# Altium project ST1-1.PrjPcb (part 1 of 5)
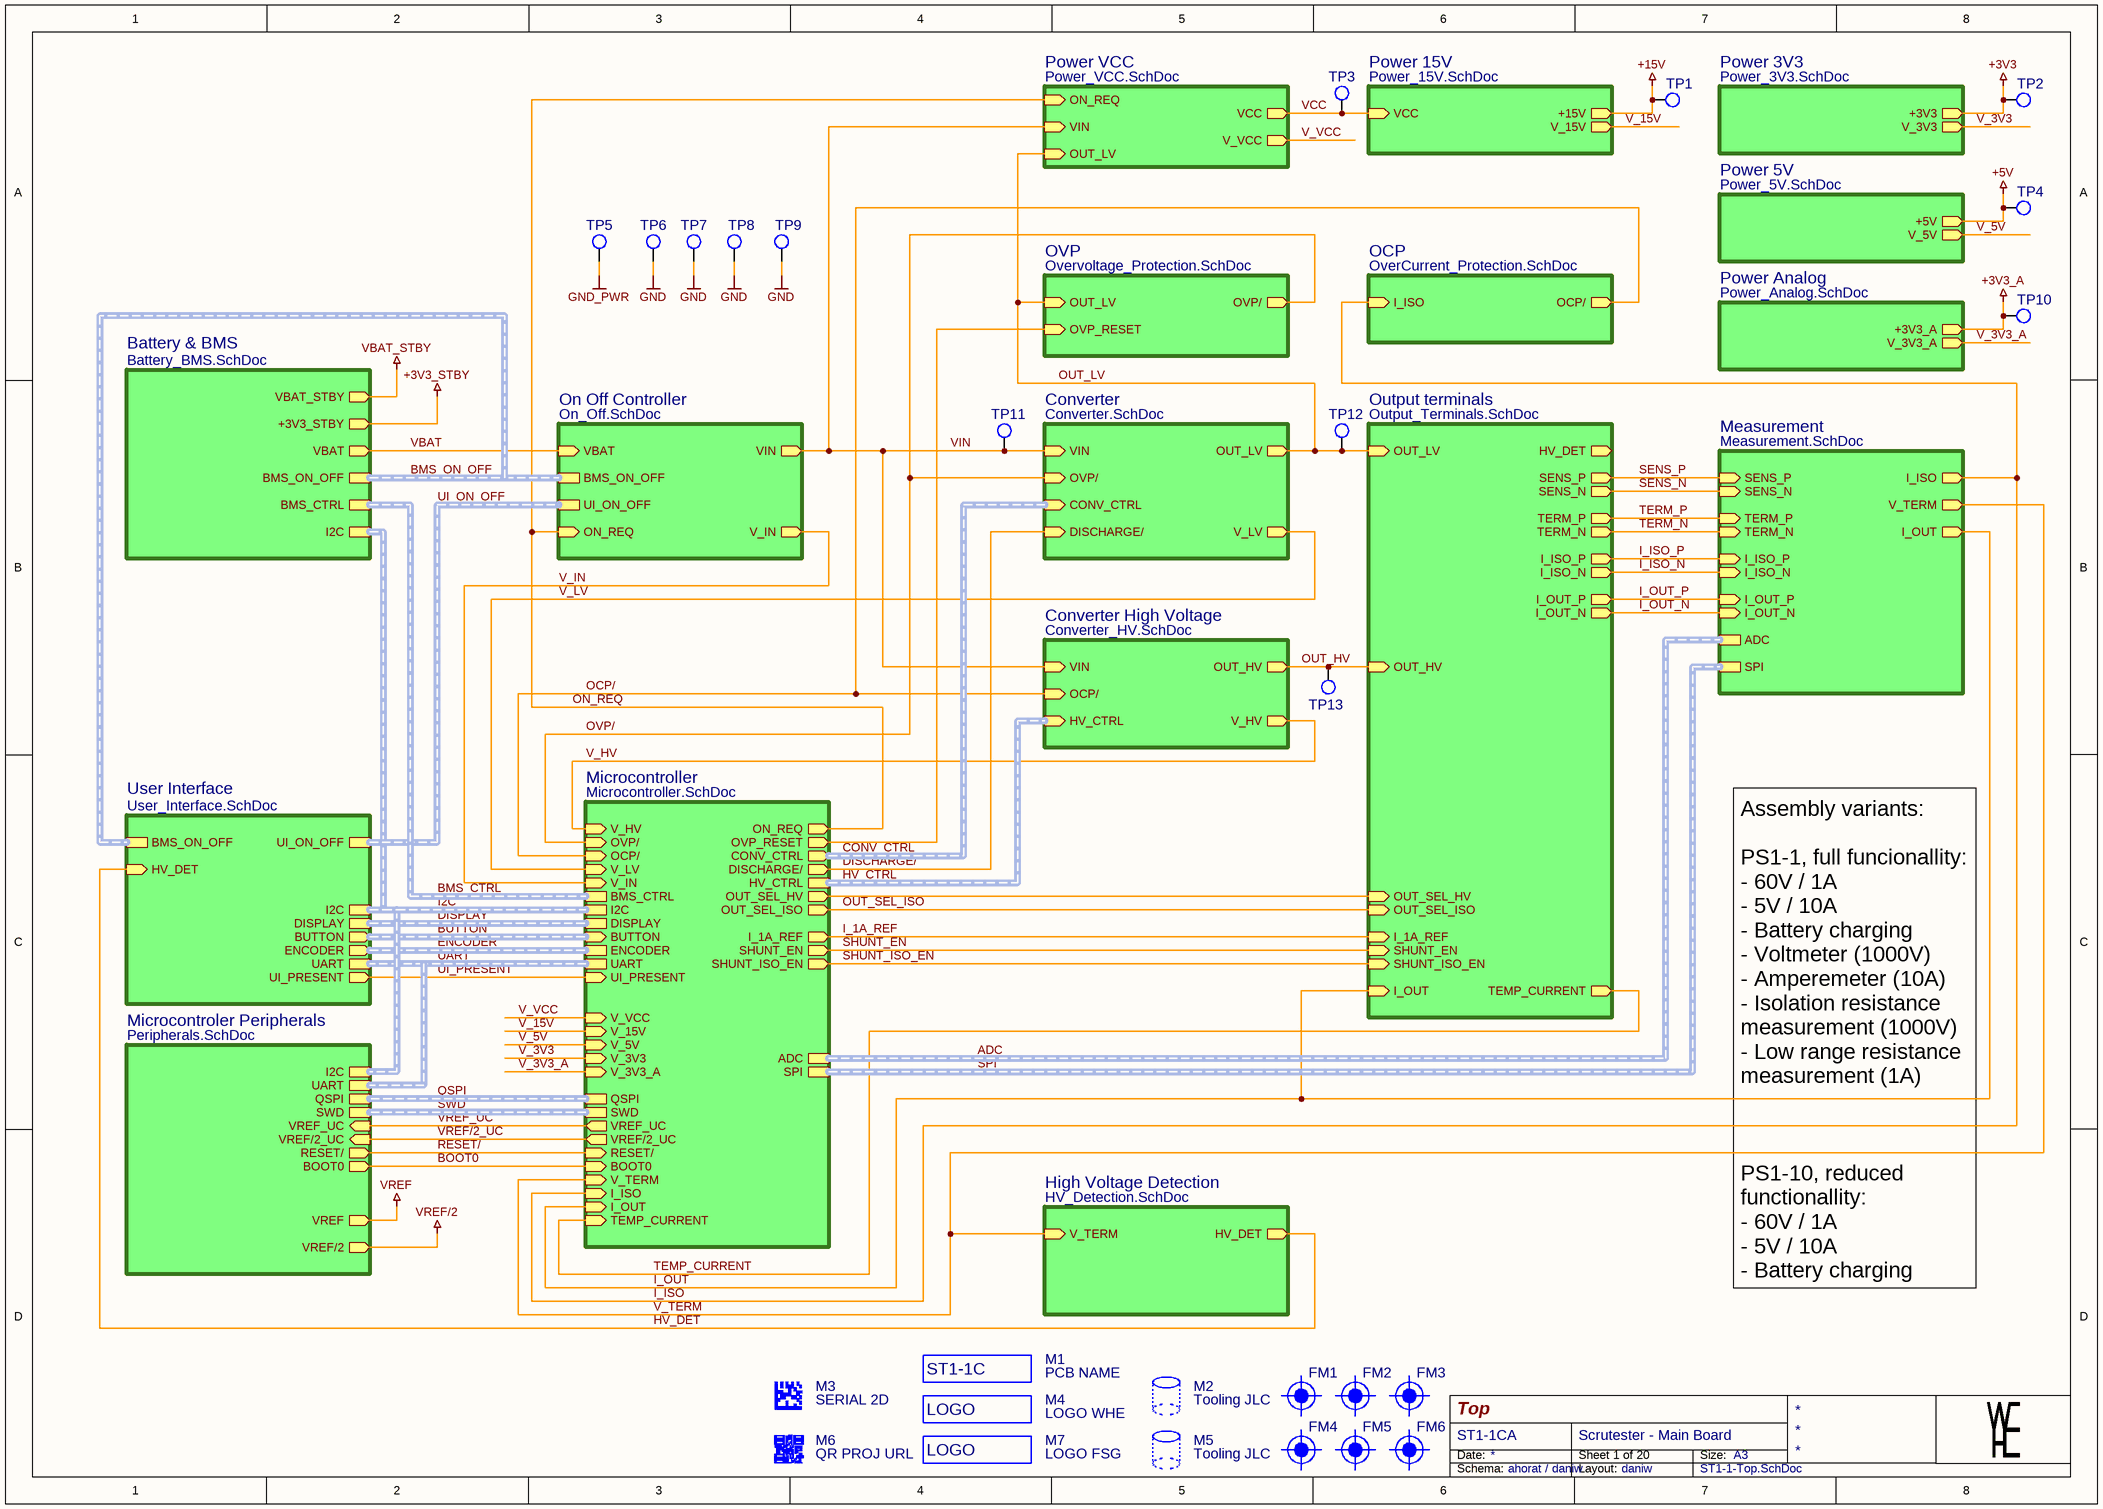
[diagram p0: ST1-1-Top.SchDoc]
Author: ahorat / daniw; Index_Main: C; Index_Sub: A; Layout_Designer: daniw; PCB_NAME: ST1-1; Project: Scrutester - Main Board; Project_URL: https://github.com/daniw/scrutester; Schema_Designer: ahorat / daniw
14 sheets, 534 parts. Net scope: hierarchical (ports join the sheet entries above them; power ports are global).
Board files: ST1-1-BASIS.PcbDoc, ST1-1-PANEL.PcbDoc
Sheets:
  ST1-1-Top.SchDoc
    Microcontroller = Microcontroller.SchDoc
    Battery & BMS = Battery_BMS.SchDoc
    User Interface = User_Interface.SchDoc
    Converter = Converter.SchDoc
    On Off Controller = On_Off.SchDoc
    Output terminals = Output_Terminals.SchDoc
      Precision Current Controller = Current_Controller.SchDoc
    Measurement = Measurement.SchDoc
    OVP = Overvoltage_Protection.SchDoc
    Microcontroler Peripherals = Peripherals.SchDoc
    OCP = Overcurrent_Protection.SchDoc
    High Voltage Detection = HV_Detection.SchDoc
  Iso_Current_Limit.SchDoc

## Sheet ST1-1-Top.SchDoc: Top
size A3; DocumentNumber: 1; SheetNumber: 1; SheetTotal: 20

### Parts
FM1  Fidu  [FIDU-1MM]  (value not drawn)  (no BOM)
FM2  Fidu  [FIDU-1MM]  (value not drawn)  (no BOM)
FM3  Fidu  [FIDU-1MM]  (value not drawn)  (no BOM)
FM4  Fidu  [FIDU-1MM]  (value not drawn)  (no BOM)
FM5  Fidu  [FIDU-1MM]  (value not drawn)  (no BOM)
FM6  Fidu  [FIDU-1MM]  (value not drawn)  (no BOM)
M1  PCB NAME  [PCB-NAME-5MM-LEFT]
M2  Tooling JLC  [TOOLING-JLC]
M3  SERIAL 2D  [SERIAL-2D-10MM-RESTRICT]
M4  LOGO WHE  [LOGO-WHE-10MM]
M5  Tooling JLC  [TOOLING-JLC]
M6  QR PROJ URL  [QR-PROJECT-URL-10MM]
M7  LOGO FSG  [LOGO-FSG-10MM]
TP1  TP_THD_1.5/0.8  [TP_THD_1.5/0.8]  (value not drawn)  (no BOM)
TP2  TP_THD_1.5/0.8  [TP_THD_1.5/0.8]  (value not drawn)  (no BOM)
TP3  TP_THD_1.5/0.8  [TP_THD_1.5/0.8]  (value not drawn)  (no BOM)
TP4  TP_THD_1.5/0.8  [TP_THD_1.5/0.8]  (value not drawn)  (no BOM)
TP5  TP_THD_1.5/0.8  [TP_THD_1.5/0.8]  (value not drawn)  (no BOM)
TP6  TP_THD_1.5/0.8  [TP_THD_1.5/0.8]  (value not drawn)  (no BOM)
TP7  TP_THD_1.5/0.8  [TP_THD_1.5/0.8]  (value not drawn)  (no BOM)
TP8  TP_THD_1.5/0.8  [TP_THD_1.5/0.8]  (value not drawn)  (no BOM)
TP9  TP_THD_1.5/0.8  [TP_THD_1.5/0.8]  (value not drawn)  (no BOM)
TP10  TP_THD_1.5/0.8  [TP_THD_1.5/0.8]  (value not drawn)  (no BOM)
TP11  TP_THD_1.5/0.8  [TP_THD_1.5/0.8]  (value not drawn)  (no BOM)
TP12  TP_THD_1.5/0.8  [TP_THD_1.5/0.8]  (value not drawn)  (no BOM)
TP13  TP_THD_1.5/0.8  [TP_THD_1.5/0.8]  (value not drawn)  (no BOM)

### Sub-sheets
Battery & BMS = Battery_BMS.SchDoc: VBAT (out), I2C (harness I2C), BMS_ON_OFF (harness BMS_ON_OFF), VBAT_STBY (out), BMS_CTRL (harness BMS_CTRL), +3V3_STBY (out)
Converter = Converter.SchDoc: VIN (in), CONV_CTRL (in, harness CONV_CTRL), OUT_LV (out), OVP/ (in), DISCHARGE/ (in), V_LV (out)
Converter High Voltage = Converter_HV.SchDoc (file not in this document): VIN (in), OUT_HV (out), OCP/ (in), HV_CTRL (in, harness HV_CTRL), V_HV (out)
High Voltage Detection = HV_Detection.SchDoc: V_TERM (in), HV_DET (out)
Measurement = Measurement.SchDoc: SENS_N (in), SENS_P (in), ADC (harness ADC), SPI (harness SPI), TERM_P (in), TERM_N (in), V_TERM (out), I_OUT (out), I_OUT_P (in), I_OUT_N (in), I_ISO_P (in), I_ISO_N (in), I_ISO (out)
Microcontroler Peripherals = Peripherals.SchDoc: I2C (harness I2C), UART (harness UART), QSPI (harness QSPI), VREF (out), SWD (harness SWD), VREF_UC (in), RESET/ (out), BOOT0 (out), VREF/2 (out), VREF/2_UC (in)
Microcontroller = Microcontroller.SchDoc: CONV_CTRL (out, harness CONV_CTRL), ON_REQ (out), I_1A_REF (out), SHUNT_EN (out), SPI (harness SPI), OUT_SEL_ISO (out), SHUNT_ISO_EN (out), V_HV (in), DISCHARGE/ (out), OVP/ (in), OUT_SEL_HV (out), HV_CTRL (harness HV_CTRL), OVP_RESET (out), OCP/ (in), BOOT0 (in), RESET/ (in), VREF/2_UC (out), VREF_UC (out), SWD (harness SWD), QSPI (harness QSPI), V_3V3_A (in), V_3V3 (in), V_5V (in), V_15V (in), V_VCC (in), UI_PRESENT (in), BMS_CTRL (harness BMS_CTRL), V_IN (in), V_LV (in), UART (harness UART), ENCODER (harness Encoder), BUTTON (in, harness BUTTON), DISPLAY (harness DISPLAY), I2C (harness I2C), ADC (harness ADC), TEMP_CURRENT (in), I_OUT (in), V_TERM (in), I_ISO (in)
OCP = OverCurrent_Protection.SchDoc: I_ISO (in), OCP/ (out)
On Off Controller = On_Off.SchDoc: VIN (out), VBAT (in), ON_REQ (in), V_IN (out), UI_ON_OFF (harness ON_OFF), BMS_ON_OFF (harness BMS_ON_OFF)
Output terminals = Output_Terminals.SchDoc: SENS_P (out), SENS_N (out), TERM_P (out), TERM_N (out), I_OUT_P (out), I_OUT_N (out), I_ISO_P (out), I_ISO_N (out), HV_DET (out), OUT_LV (in), OUT_SEL_HV (in), OUT_SEL_ISO (in), TEMP_CURRENT (out), I_OUT (in), I_1A_REF (in), SHUNT_EN (in), SHUNT_ISO_EN (in), OUT_HV (in)
OVP = Overvoltage_Protection.SchDoc: OUT_LV (in), OVP/ (out), OVP_RESET (in)
Power 3V3 = Power_3V3.SchDoc (file not in this document): +3V3 (out), V_3V3 (out)
Power 5V = Power_5V.SchDoc (file not in this document): +5V (out), V_5V (out)
Power 15V = Power_15V.SchDoc (file not in this document): +15V (out), VCC (in), V_15V (out)
Power Analog = Power_Analog.SchDoc (file not in this document): +3V3_A (out), V_3V3_A (out)
Power VCC = Power_VCC.SchDoc (file not in this document): VIN (in), OUT_LV (in), VCC (out), ON_REQ (in), V_VCC (out)
User Interface = User_Interface.SchDoc: ENCODER (out, harness Encoder), BUTTON (out, harness BUTTON), UI_ON_OFF (harness ON_OFF), I2C (harness I2C), HV_DET (in), UART (harness UART), UI_PRESENT (out), DISPLAY (harness DISPLAY), BMS_ON_OFF (harness BMS_ON_OFF)

### Nets
+3V3: TP2.1 ; sheet Power 3V3/+3V3
+3V3_A: TP10.1 ; sheet Power Analog/+3V3_A
+5V: TP4.1 ; sheet Power 5V/+5V
+15V: TP1.1 ; sheet Power 15V/+15V
GND: TP6.1 TP7.1 TP8.1 TP9.1
GND_PWR: TP5.1
BOOT0: sheet Microcontroller/BOOT0, sheet Microcontroler Peripherals/BOOT0
DISCHARGE/: sheet Microcontroller/DISCHARGE/, sheet Converter/DISCHARGE/
HV_DET: sheet User Interface/HV_DET, sheet High Voltage Detection/HV_DET
I_1A_REF: sheet Microcontroller/I_1A_REF, sheet Output terminals/I_1A_REF
I_ISO: sheet Microcontroller/I_ISO, sheet Measurement/I_ISO, sheet OCP/I_ISO
I_ISO_N: sheet Output terminals/I_ISO_N, sheet Measurement/I_ISO_N
I_ISO_P: sheet Output terminals/I_ISO_P, sheet Measurement/I_ISO_P
I_OUT: sheet Microcontroller/I_OUT, sheet Output terminals/I_OUT, sheet Measurement/I_OUT
I_OUT_N: sheet Output terminals/I_OUT_N, sheet Measurement/I_OUT_N
I_OUT_P: sheet Output terminals/I_OUT_P, sheet Measurement/I_OUT_P
OCP/: sheet Microcontroller/OCP/, sheet Converter High Voltage/OCP/, sheet OCP/OCP/
ON_REQ: sheet Microcontroller/ON_REQ, sheet On Off Controller/ON_REQ, sheet Power VCC/ON_REQ
OUT_HV: TP13.1 ; sheet Output terminals/OUT_HV, sheet Converter High Voltage/OUT_HV
OUT_LV: TP12.1 ; sheet Converter/OUT_LV, sheet Output terminals/OUT_LV, sheet Power VCC/OUT_LV, sheet OVP/OUT_LV
OUT_SEL_HV: sheet Microcontroller/OUT_SEL_HV, sheet Output terminals/OUT_SEL_HV
OUT_SEL_ISO: sheet Microcontroller/OUT_SEL_ISO, sheet Output terminals/OUT_SEL_ISO
OVP/: sheet Microcontroller/OVP/, sheet Converter/OVP/, sheet OVP/OVP/
OVP_RESET: sheet Microcontroller/OVP_RESET, sheet OVP/OVP_RESET
RESET/: sheet Microcontroller/RESET/, sheet Microcontroler Peripherals/RESET/
SENS_N: sheet Output terminals/SENS_N, sheet Measurement/SENS_N
SENS_P: sheet Output terminals/SENS_P, sheet Measurement/SENS_P
SHUNT_EN: sheet Microcontroller/SHUNT_EN, sheet Output terminals/SHUNT_EN
SHUNT_ISO_EN: sheet Microcontroller/SHUNT_ISO_EN, sheet Output terminals/SHUNT_ISO_EN
TEMP_CURRENT: sheet Microcontroller/TEMP_CURRENT, sheet Output terminals/TEMP_CURRENT
TERM_N: sheet Output terminals/TERM_N, sheet Measurement/TERM_N
TERM_P: sheet Output terminals/TERM_P, sheet Measurement/TERM_P
UI_PRESENT: sheet Microcontroller/UI_PRESENT, sheet User Interface/UI_PRESENT
V_3V3: sheet Microcontroller/V_3V3, sheet Power 3V3/V_3V3
V_3V3_A: sheet Microcontroller/V_3V3_A, sheet Power Analog/V_3V3_A
V_5V: sheet Microcontroller/V_5V, sheet Power 5V/V_5V
V_15V: sheet Microcontroller/V_15V, sheet Power 15V/V_15V
V_HV: sheet Microcontroller/V_HV, sheet Converter High Voltage/V_HV
V_IN: sheet Microcontroller/V_IN, sheet On Off Controller/V_IN
V_LV: sheet Microcontroller/V_LV, sheet Converter/V_LV
V_TERM: sheet Microcontroller/V_TERM, sheet Measurement/V_TERM, sheet High Voltage Detection/V_TERM
V_VCC: sheet Microcontroller/V_VCC, sheet Power VCC/V_VCC
VBAT: sheet Battery & BMS/VBAT, sheet On Off Controller/VBAT
VCC: TP3.1 ; sheet Power VCC/VCC, sheet Power 15V/VCC
VIN: TP11.1 ; sheet Converter/VIN, sheet On Off Controller/VIN, sheet Power VCC/VIN, sheet Converter High Voltage/VIN
VREF/2_UC: sheet Microcontroller/VREF/2_UC, sheet Microcontroler Peripherals/VREF/2_UC
VREF_UC: sheet Microcontroller/VREF_UC, sheet Microcontroler Peripherals/VREF_UC

### Buses and harness runs
harness ADC = sheet Measurement/ADC = sheet Microcontroller/ADC
harness BMS_CTRL = sheet Battery & BMS/BMS_CTRL = sheet Microcontroller/BMS_CTRL
harness BMS_ON_OFF = sheet Battery & BMS/BMS_ON_OFF = sheet On Off Controller/BMS_ON_OFF = sheet User Interface/BMS_ON_OFF
harness BUTTON = sheet Microcontroller/BUTTON = sheet User Interface/BUTTON
harness CONV_CTRL = sheet Converter/CONV_CTRL = sheet Microcontroller/CONV_CTRL
harness DISPLAY = sheet Microcontroller/DISPLAY = sheet User Interface/DISPLAY
harness ENCODER = sheet Microcontroller/ENCODER = sheet User Interface/ENCODER
harness HV_CTRL = sheet Converter High Voltage/HV_CTRL = sheet Microcontroller/HV_CTRL
harness I2C = sheet Battery & BMS/I2C = sheet Microcontroler Peripherals/I2C = sheet Microcontroller/I2C = sheet User Interface/I2C
harness QSPI = sheet Microcontroler Peripherals/QSPI = sheet Microcontroller/QSPI
harness SPI = sheet Measurement/SPI = sheet Microcontroller/SPI
harness SWD = sheet Microcontroler Peripherals/SWD = sheet Microcontroller/SWD
harness UART = sheet Microcontroler Peripherals/UART = sheet Microcontroller/UART = sheet User Interface/UART
harness UI_ON_OFF = sheet On Off Controller/UI_ON_OFF = sheet User Interface/UI_ON_OFF

### Notes on the sheet
- Assembly variants:
  PS1-1, full funcionallity:
  - 60V / 1A
  - 5V / 10A
  - Battery charging
  - Voltmeter (1000V)
  - Amperemeter (10A)
  - Isolation resistance measurement (1000V)
  - Low range resistance measurement (1A)
  PS1-10, reduced functionallity:
  - 60V / 1A
  - 5V / 10A
  - Battery charging
- Date:
- Size:
- A3
- Schema:
- Layout:

### Library data of the parts
FM1-FM6 = Fidu_1mm: Fiducial 1mm; Manufacturer: NONE; Part Number: Fidu_1mm
M1 = PCB NAME 5mm L: PCB name, 5mm text height, left-aligned; Manufacturer: NONE; Part Number: PCB NAME 5mm L
M2 M5 = Tooling JLC: Tooling hole for JLC (1.152mm); Manufacturer: NONE; Part Number: Tooling JLC
M3 = SERIAL 2D 10MM RESTRICT: 2D Serial number placeholder, Dotmatrix or QR, size: 10mm, restriction on top layer; Manufacturer: NONE; Part Number: SERIAL 2D 10MM RESTRICT
M4 = LOGO WHE 10MM: WHE logo, size 10mm; Manufacturer: NONE; Part Number: LOGO WHE 10MM
M6 = QR PROJ URL 10MM: QR Code, Project URL, 10mm; Manufacturer: NONE; Part Number: QR PROJ URL 10MM
M7 = LOGO FSG 10MM: FSG logo, size 10mm; Manufacturer: NONE; Part Number: LOGO FSG 10MM
TP1-TP13 = TP_THD_1.5/0.8: THT Test Point 1.5/0.8mm; Manufacturer: NONE; Part Number: TP_THD_1.5/0.8

## Sheet Microcontroller.SchDoc: Microcontroller
size A3; DocumentNumber: 13; SheetNumber: 13; SheetTotal: 19
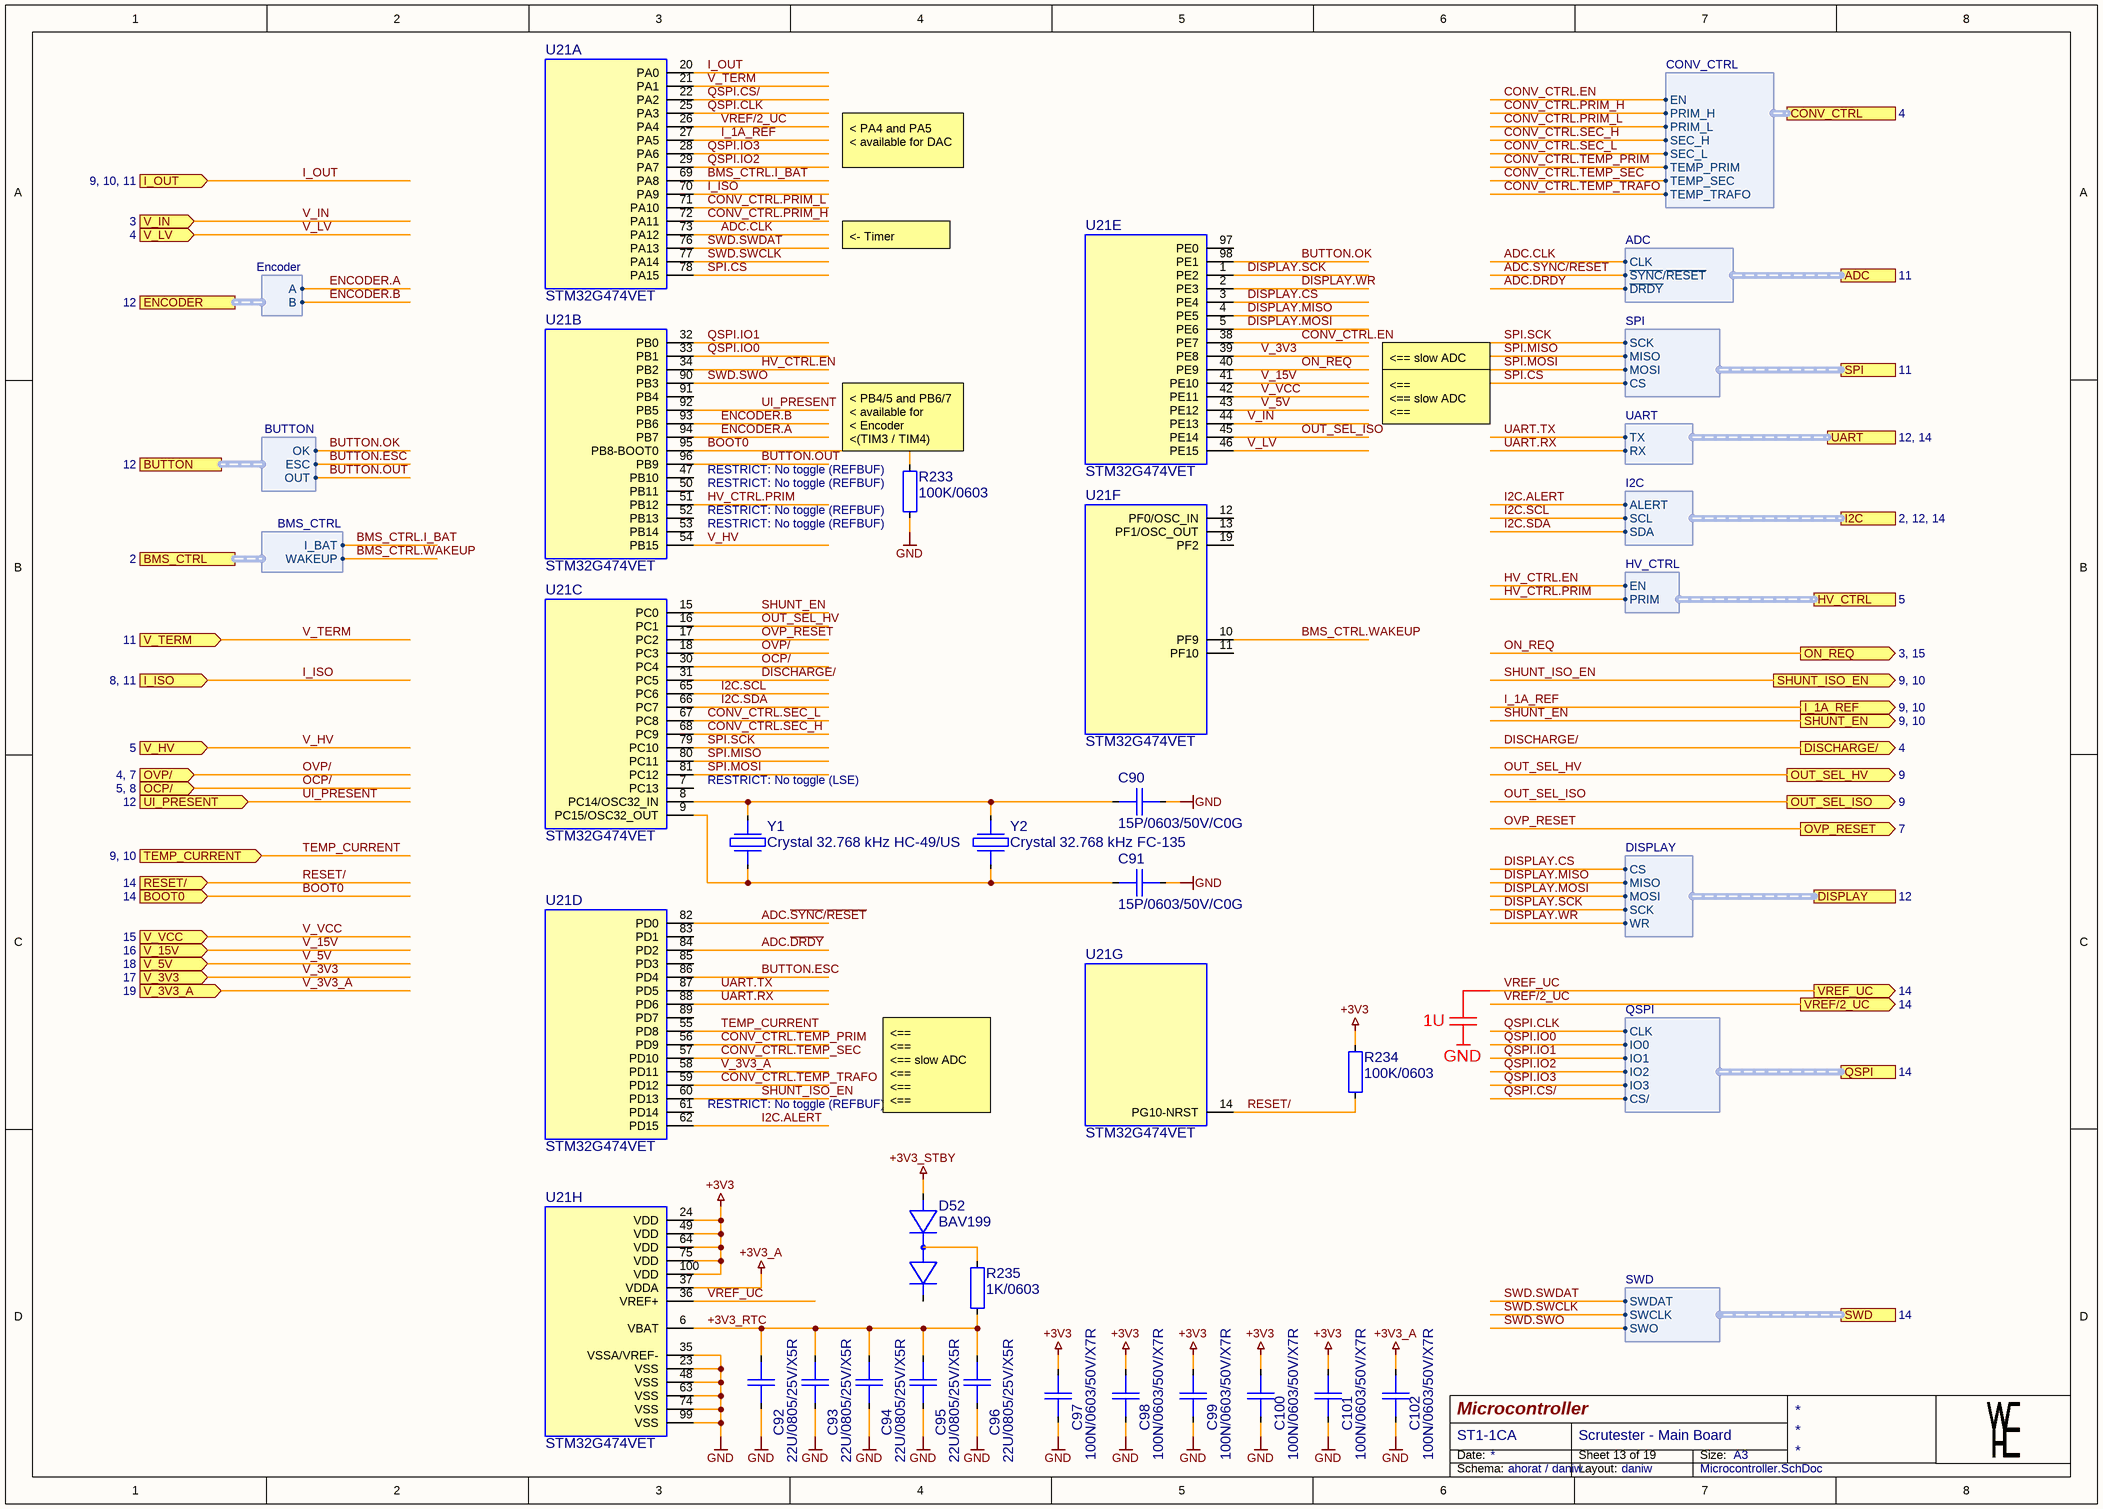
[diagram p1: Microcontroller.SchDoc]

### Parts
C90  15P/0603/50V/C0G  [CAP0603_C0G]
C91  15P/0603/50V/C0G  [CAP0603_C0G]
C92  22U/0805/25V/X5R  [CAP0805_X7R]
C93  22U/0805/25V/X5R  [CAP0805_X7R]
C94  22U/0805/25V/X5R  [CAP0805_X7R]
C95  22U/0805/25V/X5R  [CAP0805_X7R]
C96  22U/0805/25V/X5R  [CAP0805_X7R]
C97  100N/0603/50V/X7R  [CAP0603_X7R]
C98  100N/0603/50V/X7R  [CAP0603_X7R]
C99  100N/0603/50V/X7R  [CAP0603_X7R]
C100  100N/0603/50V/X7R  [CAP0603_X7R]
C101  100N/0603/50V/X7R  [CAP0603_X7R]
C102  100N/0603/50V/X7R  [CAP0603_X7R]
D52  BAV199  [SOT2395P280X125-3-SE]
R233  100K/0603  [R0603-0.40-WW]
R234  100K/0603  [R0603-0.40-WW]
R235  1K/0603  [R0603-0.40-WW]
U21  STM32G474VET  [QFP050P1600X1600X160-100]  (parts A,B,C,D,E,F,G,H of 8)
Y1  Crystal 32.768 kHz HC-49/US  [CYSMD275P760X320C230]
Y2  Crystal 32.768 kHz FC-135  [CYSMD250P320X150X090]

### Ports
ADC (harness ADC, see 11), BMS_CTRL (harness BMS_CTRL, see 2), BOOT0 (in, see 14), BUTTON (harness BUTTON, see 12), CONV_CTRL (harness CONV_CTRL, see 4), DISCHARGE/ (out, see 4), DISPLAY (harness DISPLAY, see 12), ENCODER (harness Encoder, see 12), HV_CTRL (harness HV_CTRL, see 5), I2C (harness I2C, see 2, 12, 14), I_1A_REF (out, see 9, 10), I_ISO (in, see 8, 11), I_OUT (in, see 9, 10, 11), OCP/ (in, see 5, 8), ON_REQ (out, see 3, 15), OUT_SEL_HV (out, see 9), OUT_SEL_ISO (out, see 9), OVP/ (in, see 4, 7), OVP_RESET (out, see 7), QSPI (harness QSPI, see 14), RESET/ (in, see 14), SHUNT_EN (out, see 9, 10), SHUNT_ISO_EN (out, see 9, 10), SPI (harness SPI, see 11), SWD (harness SWD, see 14), TEMP_CURRENT (in, see 9, 10), UART (harness UART, see 12, 14), UI_PRESENT (in, see 12), V_3V3 (in, see 17), V_3V3_A (in, see 19), V_5V (in, see 18), V_15V (in, see 16), V_HV (in, see 5), V_IN (in, see 3), V_LV (in, see 4), V_TERM (in, see 11), V_VCC (in, see 15), VREF/2_UC (out, see 14), VREF_UC (out, see 14)

### Harnesses
CONV_CTRL: EN, PRIM_H, SEC_H, TEMP_PRIM, TEMP_SEC, TEMP_TRAFO, PRIM_L, SEC_L
I2C: ALERT, SCL, SDA
BUTTON: ESC, OK, OUT
Encoder: A, B
ADC: CLK, ~{SYNC}/~{RESET}, ~{DRDY}
SPI: SCK, MISO, MOSI, CS
UART: TX, RX
BMS_CTRL: I_BAT, WAKEUP
HV_CTRL: EN, PRIM
DISPLAY: CS, MISO, MOSI, SCK, WR
QSPI: CLK, IO0, CS/, IO1, IO2, IO3
SWD: SWDAT, SWCLK, SWO

### Nets
+3V3: C97.1 C98.1 C99.1 C100.1 C101.1 R234.1 U21.24(VDD) U21.49(VDD) U21.64(VDD) U21.75(VDD) U21.100(VDD)
+3V3_A: C102.1 U21.37(VDDA)
+3V3_STBY: D52.1(A1)
GND: C90.2 C91.2 C92.2 C93.2 C94.2 C95.2 C96.2 C97.2 C98.2 C99.2 C100.2 C101.2 C102.2 R233.2 U21.23(VSS) U21.35(VSSA/VREF-) U21.48(VSS) U21.63(VSS) U21.74(VSS) U21.99(VSS)
+3V3_RTC: C92.1 C93.1 C94.1 C95.1 C96.1 R235.2 U21.6(VBAT)
ADC.CLK: U21.73(PA12) ; port ADC.CLK
ADC.~{DRDY}: U21.84(PD2) ; port ADC.~{DRDY}
ADC.~{SYNC}/~{RESET}: U21.82(PD0) ; port ADC.~{SYNC}/~{RESET}
BMS_CTRL.I_BAT: U21.69(PA8) ; port BMS_CTRL.I_BAT
BMS_CTRL.WAKEUP: U21.10(PF9) ; port BMS_CTRL.WAKEUP
BOOT0: R233.1 U21.95(PB8-BOOT0) ; port BOOT0
BUTTON.ESC: U21.86(PD4) ; port BUTTON.ESC
BUTTON.OK: U21.98(PE1) ; port BUTTON.OK
BUTTON.OUT: U21.96(PB9) ; port BUTTON.OUT
CONV_CTRL.EN: U21.38(PE7) ; port CONV_CTRL.EN
CONV_CTRL.PRIM_H: U21.72(PA11) ; port CONV_CTRL.PRIM_H
CONV_CTRL.PRIM_L: U21.71(PA10) ; port CONV_CTRL.PRIM_L
CONV_CTRL.SEC_H: U21.68(PC9) ; port CONV_CTRL.SEC_H
CONV_CTRL.SEC_L: U21.67(PC8) ; port CONV_CTRL.SEC_L
CONV_CTRL.TEMP_PRIM: U21.56(PD9) ; port CONV_CTRL.TEMP_PRIM
CONV_CTRL.TEMP_SEC: U21.57(PD10) ; port CONV_CTRL.TEMP_SEC
CONV_CTRL.TEMP_TRAFO: U21.59(PD12) ; port CONV_CTRL.TEMP_TRAFO
DISCHARGE/: U21.31(PC5) ; port DISCHARGE/
DISPLAY.CS: U21.3(PE4) ; port DISPLAY.CS
DISPLAY.MISO: U21.4(PE5) ; port DISPLAY.MISO
DISPLAY.MOSI: U21.5(PE6) ; port DISPLAY.MOSI
DISPLAY.SCK: U21.1(PE2) ; port DISPLAY.SCK
DISPLAY.WR: U21.2(PE3) ; port DISPLAY.WR
ENCODER.A: U21.94(PB7) ; port ENCODER.A
ENCODER.B: U21.93(PB6) ; port ENCODER.B
HV_CTRL.EN: U21.34(PB2) ; port HV_CTRL.EN
HV_CTRL.PRIM: U21.51(PB12) ; port HV_CTRL.PRIM
I2C.ALERT: U21.62(PD15) ; port I2C.ALERT
I2C.SCL: U21.65(PC6) ; port I2C.SCL
I2C.SDA: U21.66(PC7) ; port I2C.SDA
I_1A_REF: U21.27(PA5) ; port I_1A_REF
I_ISO: U21.70(PA9) ; port I_ISO
I_OUT: U21.20(PA0) ; port I_OUT
OCP/: U21.30(PC4) ; port OCP/
ON_REQ: U21.40(PE9) ; port ON_REQ
OUT_SEL_HV: U21.16(PC1) ; port OUT_SEL_HV
OUT_SEL_ISO: U21.45(PE14) ; port OUT_SEL_ISO
OVP/: U21.18(PC3) ; port OVP/
OVP_RESET: U21.17(PC2) ; port OVP_RESET
QSPI.CLK: U21.25(PA3) ; port QSPI.CLK
QSPI.CS/: U21.22(PA2) ; port QSPI.CS/
QSPI.IO0: U21.33(PB1) ; port QSPI.IO0
QSPI.IO1: U21.32(PB0) ; port QSPI.IO1
QSPI.IO2: U21.29(PA7) ; port QSPI.IO2
QSPI.IO3: U21.28(PA6) ; port QSPI.IO3
RESET/: R234.2 U21.14(PG10-NRST) ; port RESET/
SHUNT_EN: U21.15(PC0) ; port SHUNT_EN
SHUNT_ISO_EN: U21.60(PD13) ; port SHUNT_ISO_EN
SPI.CS: U21.78(PA15) ; port SPI.CS
SPI.MISO: U21.80(PC11) ; port SPI.MISO
SPI.MOSI: U21.81(PC12) ; port SPI.MOSI
SPI.SCK: U21.79(PC10) ; port SPI.SCK
SWD.SWCLK: U21.77(PA14) ; port SWD.SWCLK
SWD.SWDAT: U21.76(PA13) ; port SWD.SWDAT
SWD.SWO: U21.90(PB3) ; port SWD.SWO
TEMP_CURRENT: U21.55(PD8) ; port TEMP_CURRENT
UART.RX: U21.88(PD6) ; port UART.RX
UART.TX: U21.87(PD5) ; port UART.TX
UI_PRESENT: U21.92(PB5) ; port UI_PRESENT
V_3V3: U21.39(PE8) ; port V_3V3
V_3V3_A: U21.58(PD11) ; port V_3V3_A
V_5V: U21.43(PE12) ; port V_5V
V_15V: U21.41(PE10) ; port V_15V
V_HV: U21.54(PB15) ; port V_HV
V_IN: U21.44(PE13) ; port V_IN
V_LV: U21.46(PE15) ; port V_LV
V_TERM: U21.21(PA1) ; port V_TERM
V_VCC: U21.42(PE11) ; port V_VCC
VREF/2_UC: U21.26(PA4) ; port VREF/2_UC
VREF_UC: U21.36(VREF+) ; port VREF_UC
NetC90_1: C90.1 U21.8(PC14/OSC32_IN) Y1.1 Y2.1
NetC91_1: C91.1 U21.9(PC15/OSC32_OUT) Y1.2 Y2.2
NetD52_3: D52.3(K1/A2) R235.1

Not connected (* = marked no-connect by the designer): D52 2(K2); U21 7(PC13) 11(PF10) 12(PF0/OSC_IN) 13(PF1/OSC_OUT) 19(PF2) 47(PB10) 50(PB11) 52(PB13) 53(PB14) 61(PD14) 83(PD1) 85(PD3) 89(PD7) 91(PB4) 97(PE0)

### Notes on the sheet
- < PA4 and PA5
  < available for DAC
- <- Timer
- <== slow ADC
- (near R233) < PB4/5 and PB6/7
  < available for
  < Encoder
  <(TIM3 / TIM4)
- <==
  <== slow ADC
  <==
- RESTRICT: No toggle (REFBUF)
- RESTRICT: No toggle (LSE)
- Chose between crystals depending on available space on PCB
- 1U
- GND
- (near U21) RESTRICT: No toggle (REFBUF)
- <==
  <==
  <== slow ADC
  <==
  <==
  <==
- Date:
- Size:
- A3
- Schema:
- Layout:

### Library data of the parts
C90 C91 = 15P/0603/50V/C0G: CAP SM 0603 15pF 50V C0G; Manufacturer: GENERIC; Manufacturer 1: YAGEO; Manufacturer Part Number 1: CC0603JRNPO9BN150; Absolute Value: 1.5E-11; Eurocircuits GPN: GPC0603150-C0G; Part Number: 15P/0603/50V/C0G; Package: 0603; Value: 15pF; HelpURL: https://www.yageo.com/upload/media/product/productsearch/datasheet/mlcc/UPY-GP_NP0_16V-to-50V_18.pdf; Supplier 1: Digi-Key; Supplier Part Number 1: 311-1060-1-ND; Manufacturer 2: YAGEO; Manufacturer Part Number 2: CC0603KRNPO9BN150; Supplier 2: Digi-Key; Supplier Part Number 2: 311-4028-1-ND; JLC Type: Basic; Manufacturer Part Number 3: Samsung Electro-Mechanics; Supplier 3: LCSC; Supplier Part Number 3: C1644
C92-C96 = 22U/0805/25V/X5R: CAP SM 0805 22uF 25V X5R; Manufacturer: GENERIC; Manufacturer 1: Samsung Electro-Mechanics; Manufacturer Part Number 1: CL21A226MAYNNNE; Absolute Value: 2.2E-5; Eurocircuits GPN: GPN0805106-25; Part Number: 22U/0805/25V/X5R; Package: 0805; Value: 22uF; HelpURL: https://mm.digikey.com/Volume0/opasdata/d220001/medias/docus/339/CL21A226MAYNNNE_Spec.pdf; Supplier 1: Digi-Key; Supplier Part Number 1: 1276-CL21A226MAYNNNECT-ND; Manufacturer Part Number 3: CL21A226MAQNNNE; Supplier 3: LCSC; Supplier Part Number 3: C45783; JLC Type: Basic
C97-C102 = 100N/0603/50V/X7R: CAP SM 0603 100nF 50V X7R; Manufacturer: GENERIC; Manufacturer 1: YAGEO; Manufacturer Part Number 1: CC0603KPX7R9BB104; Absolute Value: 1E-7; Eurocircuits GPN: GPC0603104; Part Number: 100N/0603/50V/X7R; Package: 0603; Value: 100nF; HelpURL: https://www.yageo.com/upload/media/product/app/datasheet/mlcc/upy-gphc_x7r_6_3v-to-250v.pdf; Supplier 1: Digi-Key; Supplier Part Number 1: 311-3567-1-ND; Supplier 3: LCSC; Supplier Part Number 3: C14663; Manufacturer 2: YAGEO; Manufacturer Part Number 2: CC0603MRX7R9BB104; Supplier 2: Digi-Key; Supplier Part Number 2: 311-4110-1-ND; JLC Type: Basic; Manufacturer Part Number 3: CC0603KRX7R9BB104
D52 = BAV199: Silicon Low Leakage Diode 85V; Manufacturer: Infineon Technologies; Manufacturer Part Number 1: BAV199E6433HTMA1; Part Number: BAV199; Package: SOT23; Value: BAV199; Absolute Value: 85V; HelpURL: https://www.infineon.com/dgdl/bav199series.pdf?folderId=db3a30431400ef6801141c748874044e&fileId=db3a30431400ef6801141cba733104e5; Manufacturer 1: Infineon Technologies; Supplier 1: Digikey; Supplier Part Number 1: BAV199E6433HTMA1CT-ND; Manufacturer 3: LRC; Manufacturer Part Number 3: LBAV199LT1G; Supplier 3: LCSC; Supplier Part Number 3: C12740
R233 R234 = 100K/0603: RES SM 0603 100K; Manufacturer: GENERIC; Manufacturer 1: YAGEO; Manufacturer Part Number 1: RC0603FR-13100KL; Absolute Value: 100000; Eurocircuits GPN: GPR0603100K; Part Number: 100K/0603; Package: 0603; Value: 100K; HelpURL: https://www.yageogroup.com/content/datasheet/asset/file/PYU-RC_GROUP_51_ROHS_L; Supplier 1: Digi-Key; Supplier Part Number 1: 13-RC0603FR-13100KLCT-ND; Manufacturer 2: YAGEO; Manufacturer Part Number 2: RC0603FR-10100KL; Supplier 2: Digi-Key; Supplier Part Number 2: 13-RC0603FR-10100KLCT-ND; Manufacturer 3: UNI-ROYAL(Uniroyal Elec); Manufacturer Part Number 3: 0603WAF1003T5E; Supplier 3: LCSC; Supplier Part Number 3: C25803; JLC Type: Basic
R235 = 1K/0603: RES SM 0603 1K; Manufacturer: GENERIC; Manufacturer 1: YAGEO; Manufacturer Part Number 1: RC0603FR-131KL; Absolute Value: 1000; Eurocircuits GPN: GPR06031K; Part Number: 1K/0603; Package: 0603; Value: 1K; HelpURL: https://www.yageogroup.com/content/datasheet/asset/file/PYU-RC_GROUP_51_ROHS_L; Supplier 1: Digi-Key; Supplier Part Number 1: 13-RC0603FR-131KLCT-ND; Manufacturer 2: YAGEO; Manufacturer Part Number 2: RC0603FR-101KL; Supplier 2: Digi-Key; Supplier Part Number 2: 13-RC0603FR-101KLCT-ND; Manufacturer 3: UNI-ROYAL(Uniroyal Elec); Manufacturer Part Number 3: 0603WAF1001T5E; Supplier 3: LCSC; Supplier Part Number 3: C21190; JLC Type: Basic
U21 = STM32G474VET: STM32G474VET, Arm® Cortex®-M4 32-bit MCU+FPU, 170 MHz / 213 DMIPS, 512 kB flash, 128 KB SRAM, rich analog, math acc, 184 ps 12 chan Hi-res timer, QFP-100; Manufacturer: ST Microelectronics; Manufacturer 1: STMicroelectronics; Manufacturer Part Number 1: STM32G474VET6; Part Number: STM32G474VET; Package: QFP-100; HelpURL: https://www.st.com/resource/en/datasheet/stm32g474ve.pdf; Supplier 1: Digi-Key; Supplier Part Number 1: 497-19476-ND; Manufacturer 2: STMicroelectronics; Manufacturer Part Number 2: STM32G474VET3; Supplier 2: Digi-Key; Supplier Part Number 2: 497-STM32G474VET3-ND; Manufacturer 3: STMicroelectronics; Manufacturer Part Number 3: STM32G474VET6TR; Supplier 3: LCSC; Supplier Part Number 3: C1857438; JLC Type: Extended
Y1 = Crystal 32.768 kHz HC-49/US: 32.768 kHz ±20ppm Crystal 12,5pF HC-49/US; Manufacturer: CJKJ; Part Number: Crystal 32.768 kHz HC-49/US; Package: HC-49/US; HelpURL: https://www.lcsc.com/datasheet/C1122370.pdf; Manufacturer 3: CJKJ; Manufacturer Part Number 3: C30732.768N12.5M20; Supplier 3: LCSC; Supplier Part Number 3: C1122370; JLC Type: Extended
Y2 = Crystal 32.768 kHz FC-135: 32.768 kHz ±20ppm Crystal 12,5pF FC-135; Manufacturer: Epson; Manufacturer Part Number 1: FC-135 32.7680KA-A5; Part Number: Crystal 32.768 kHz FC-135; Package: FC-135; HelpURL: https://support.epson.biz/td/api/doc_check.php?dl=brief_FC-135; Manufacturer 1: EPSON; Supplier 1: Digi-Key; Supplier Part Number 1: SER4103CT-ND; Manufacturer 3: EPSON; Manufacturer Part Number 3: Q13FC13500004; Supplier 3: LCSC; Supplier Part Number 3: C32346; JLC Type: Basic

## Sheet Battery_BMS.SchDoc: Battery & BMS
size A3; DocumentNumber: 2; SheetNumber: 2; SheetTotal: 19
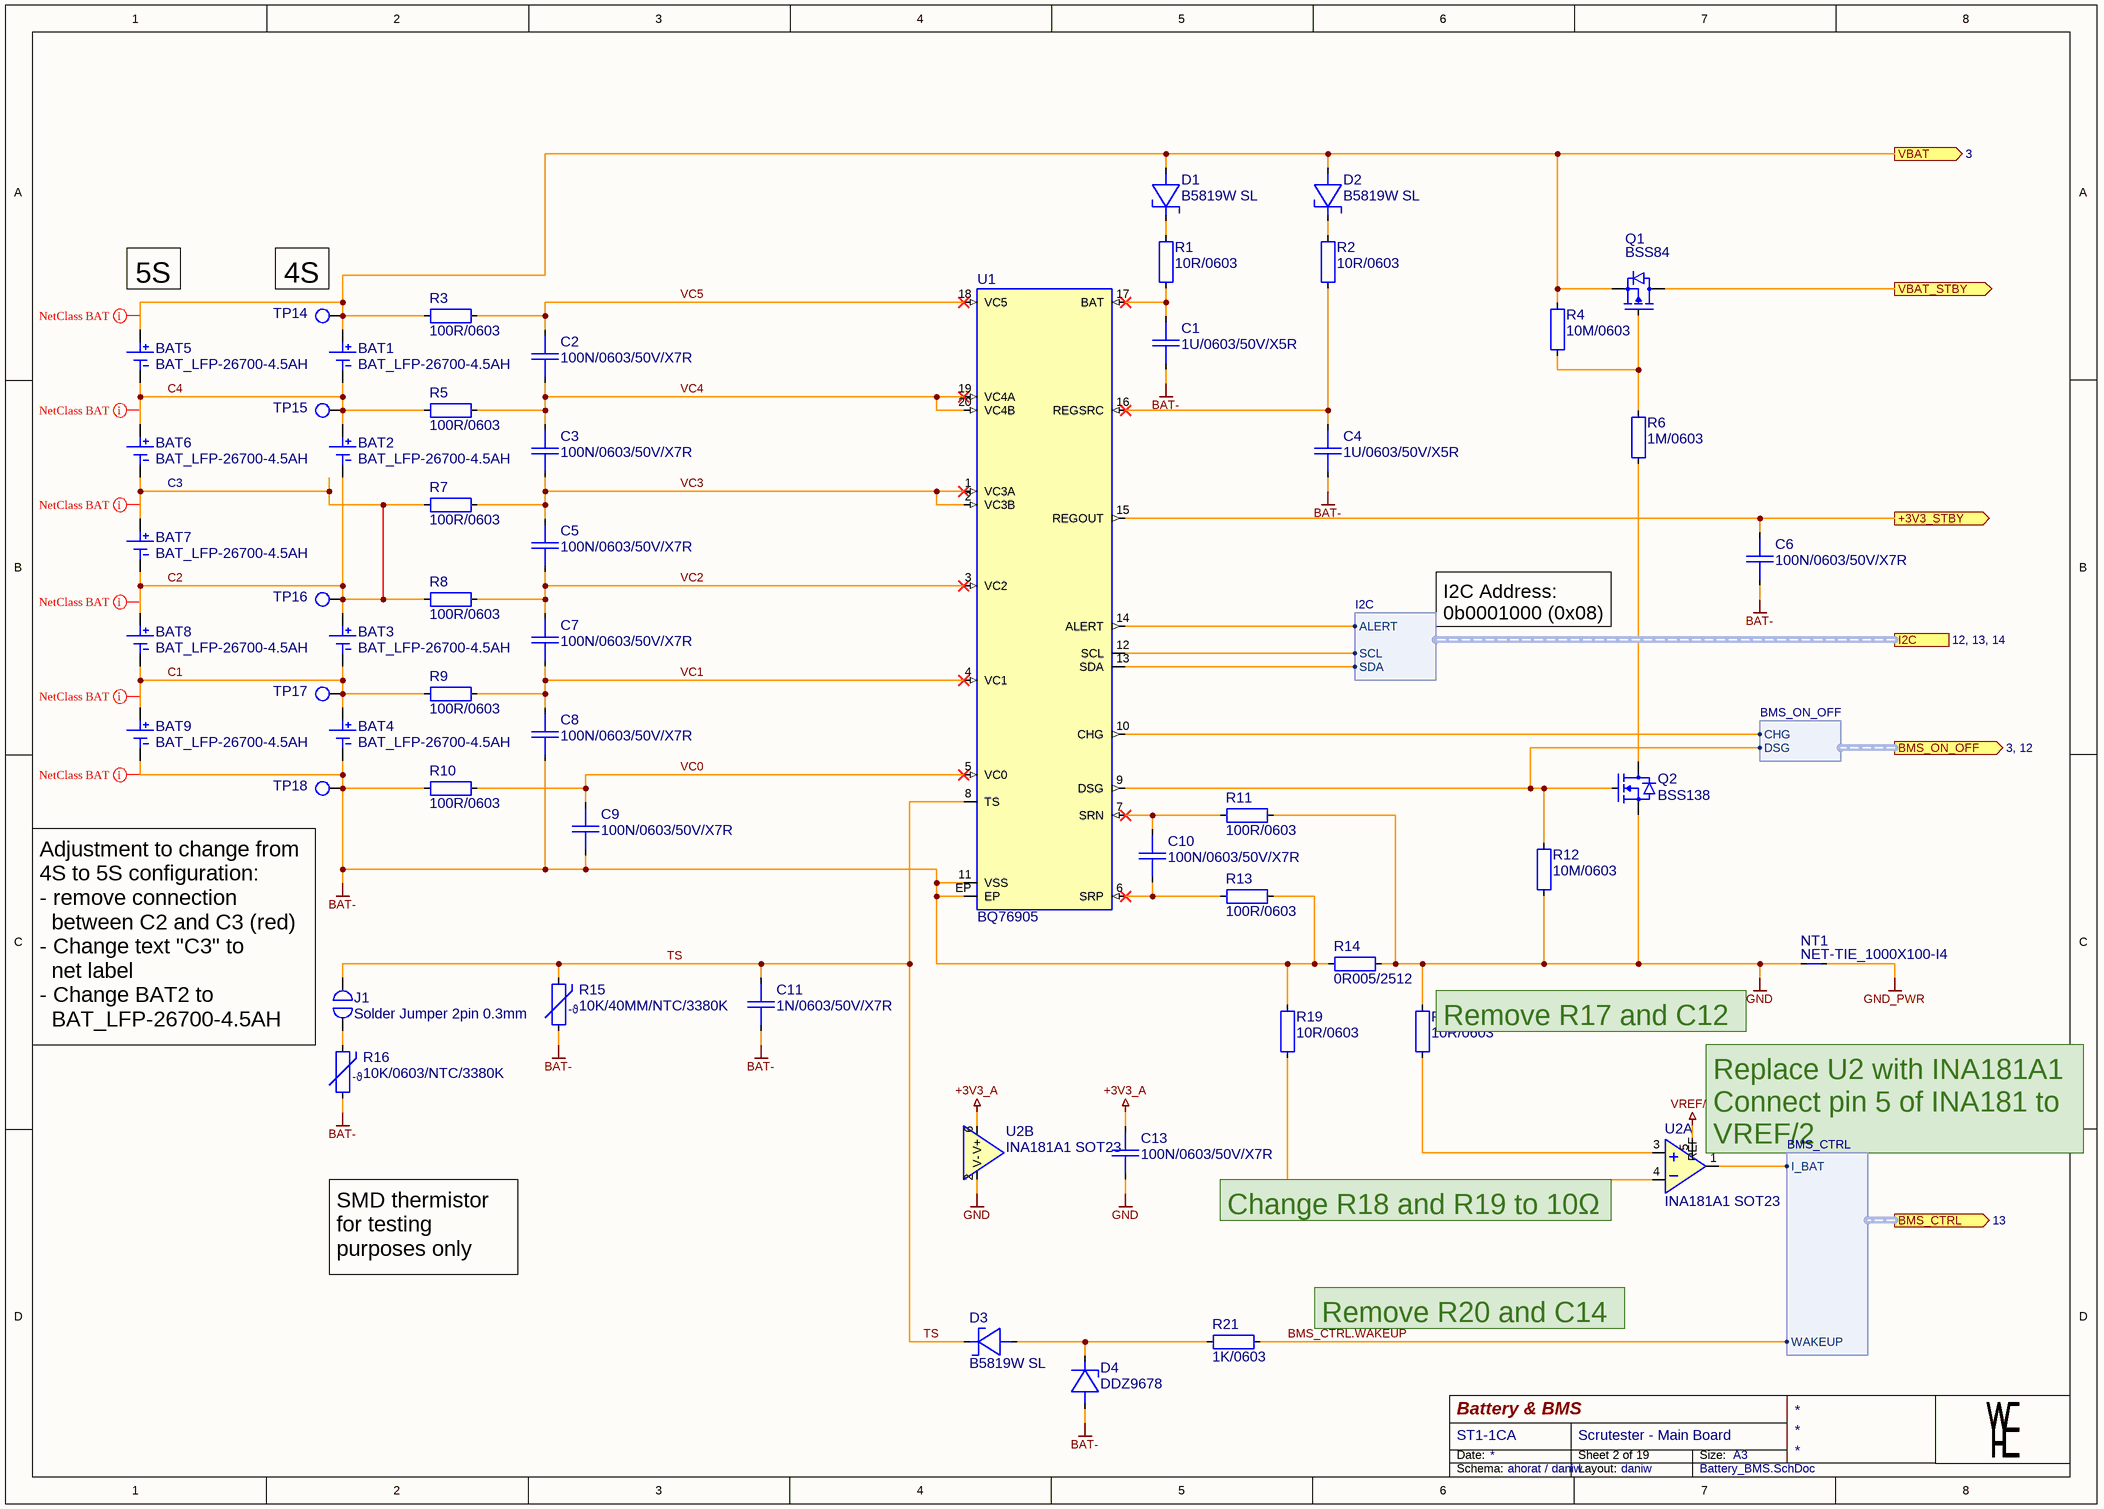
[diagram p2: Battery_BMS.SchDoc]

### Parts
BAT1  BAT_LFP-26700-4.5AH  [BAT-26700-PS]
BAT2  BAT_LFP-26700-4.5AH  [BAT-26700-PS]
BAT3  BAT_LFP-26700-4.5AH  [BAT-26700-PS]
BAT4  BAT_LFP-26700-4.5AH  [BAT-26700-PS]
BAT5  BAT_LFP-26700-4.5AH  [BAT-26700-PS]  (graphical)
BAT6  BAT_LFP-26700-4.5AH  [BAT-26700-PS]  (graphical)
BAT7  BAT_LFP-26700-4.5AH  [BAT-26700-PS]  (graphical)
BAT8  BAT_LFP-26700-4.5AH  [BAT-26700-PS]  (graphical)
BAT9  BAT_LFP-26700-4.5AH  [BAT-26700-PS]  (graphical)
C1  1U/0603/50V/X5R  [CAP0603_X7R]
C2  100N/0603/50V/X7R  [CAP0603_X7R]
C3  100N/0603/50V/X7R  [CAP0603_X7R]
C4  1U/0603/50V/X5R  [CAP0603_X7R]
C5  100N/0603/50V/X7R  [CAP0603_X7R]
C6  100N/0603/50V/X7R  [CAP0603_X7R]
C7  100N/0603/50V/X7R  [CAP0603_X7R]
C8  100N/0603/50V/X7R  [CAP0603_X7R]
C9  100N/0603/50V/X7R  [CAP0603_X7R]
C10  100N/0603/50V/X7R  [CAP0603_X7R]
C11  1N/0603/50V/X7R  [CAP0603_X7R]
C13  100N/0603/50V/X7R  [CAP0603_X7R]
D1  B5819W SL  [SOD3718X125]
D2  B5819W SL  [SOD3718X125]
D3  B5819W SL  [SOD3718X125]
D4  DDZ9678  [SOD3718X125]
J1  Solder Jumper 2pin 0.3mm  [Solder_Jumper_2pin_0.3mm]
NT1  NET-TIE_1000X100-I4  [NET-TIE_1000X100]  (net tie, no BOM)
Q1  BSS84  [SOT2395P280X125-3-SE]
Q2  BSS138  [SOT2395P280X125-3-SE]
R1  10R/0603  [R0603-0.40-WW]
R2  10R/0603  [R0603-0.40-WW]
R3  100R/0603  [R0603-0.40-WW]
R4  10M/0603  [R0603-0.40-WW]
R5  100R/0603  [R0603-0.40-WW]
R6  1M/0603  [R0603-0.40-WW]
R7  100R/0603  [R0603-0.40-WW]
R8  100R/0603  [R0603-0.40-WW]
R9  100R/0603  [R0603-0.40-WW]
R10  100R/0603  [R0603-0.40-WW]
R11  100R/0603  [R0603-0.40-WW]
R12  10M/0603  [R0603-0.40-WW]
R13  100R/0603  [R0603-0.40-WW]
R14  0R005/2512  [R2512-0.65-WW]
R15  10K/40MM/NTC/3380K  [RESD200W25D200H4000]
R16  10K/0603/NTC/3380K  [R0603-0.40-WW]
R18  10R/0603  [R0603-0.40-WW]
R19  10R/0603  [R0603-0.40-WW]
R21  1K/0603  [R0603-0.40-WW]
TP14  TP_THD_1.5/0.8  [TP_THD_1.5/0.8]  (value not drawn)  (no BOM)
TP15  TP_THD_1.5/0.8  [TP_THD_1.5/0.8]  (value not drawn)  (no BOM)
TP16  TP_THD_1.5/0.8  [TP_THD_1.5/0.8]  (value not drawn)  (no BOM)
TP17  TP_THD_1.5/0.8  [TP_THD_1.5/0.8]  (value not drawn)  (no BOM)
TP18  TP_THD_1.5/0.8  [TP_THD_1.5/0.8]  (value not drawn)  (no BOM)
U1  BQ76905  [QFN050P350X350X100-20-EP200X200]
U2  INA181A1 SOT23  [SOT2395P280X125-6-SE]  (parts A,B of 2)

### Ports
+3V3_STBY (out), BMS_CTRL (out, harness BMS_CTRL, see 13), BMS_ON_OFF (out, harness BMS_ON_OFF, see 3, 12), I2C (harness I2C, see 12, 13, 14), VBAT (out, see 3), VBAT_STBY (out)

### Harnesses
I2C: ALERT, SCL, SDA
BMS_ON_OFF: CHG, DSG
BMS_CTRL: I_BAT, WAKEUP

### Nets
+3V3_A: C13.1 U2.6(V+)
+3V3_STBY: C6.1 U1.15(REGOUT) ; port +3V3_STBY
BAT-: BAT4.2(-) BAT9.2(-) C1.2 C4.2 C6.2 C8.2 C9.2 C11.2 D4.2(A) R10.1 R13.2 R14.1 R15.2 R16.2 R19.1 TP18.1 U1.11(VSS) U1.EP
GND: C13.2 NT1.1 Q2.2(SOURCE) R11.2 R12.2 R14.2 R18.1 U2.2(V-)
GND_PWR: NT1.2
VBAT_STBY: Q1.3(DRAIN) ; port VBAT_STBY
VREF/2: U2.5(REF)
BMS_CTRL.I_BAT: U2.1(OUT) ; port BMS_CTRL.I_BAT
BMS_CTRL.WAKEUP: R21.2 ; port BMS_CTRL.WAKEUP
BMS_ON_OFF.CHG: U1.10(CHG) ; port BMS_ON_OFF.CHG
BMS_ON_OFF.DSG: Q2.1(GATE) R12.1 U1.9(DSG) ; port BMS_ON_OFF.DSG
C1: BAT3.2(-) BAT4.1(+) BAT8.2(-) BAT9.1(+) R9.1 TP17.1
C2: BAT2.2(-) BAT3.1(+) BAT6.2(-) BAT7.1(+) BAT7.2(-) BAT8.1(+) R7.1 R8.1 TP16.1
C4: BAT1.2(-) BAT2.1(+) BAT5.2(-) BAT6.1(+) R5.1 TP15.1
I2C.ALERT: U1.14(ALERT) ; port I2C.ALERT
I2C.SCL: U1.12(SCL) ; port I2C.SCL
I2C.SDA: U1.13(SDA) ; port I2C.SDA
TS: C11.1 D3.1(C) J1.1 R15.1 U1.8(TS)
VBAT: BAT1.1(+) BAT5.1(+) D1.2(A) D2.2(A) Q1.2(SOURCE) R3.1 R4.1 TP14.1 ; port VBAT
VC0: C9.1 R10.2 U1.5(VC0)
VC1: C7.2 C8.1 R9.2 U1.4(VC1)
VC2: C5.2 C7.1 R8.2 U1.3(VC2)
VC3: C3.2 C5.1 R7.2 U1.1(VC3A) U1.2(VC3B)
VC4: C2.2 C3.1 R5.2 U1.19(VC4A) U1.20(VC4B)
VC5: C2.1 R3.2 U1.18(VC5)
NetC1_1: C1.1 R1.2 U1.17(BAT)
NetC4_1: C4.1 R2.2 U1.16(REGSRC)
NetC10_1: C10.1 R11.1 U1.7(SRN)
NetC10_2: C10.2 R13.1 U1.6(SRP)
NetD1_1: D1.1(C) R1.1
NetD2_1: D2.1(C) R2.1
NetD3_2: D3.2(A) D4.1(C) R21.1
NetJ1_2: J1.2 R16.1
NetQ1_1: Q1.1(GATE) R4.2 R6.1
NetQ2_3: Q2.3(DRAIN) R6.2
NetR18_2: R18.2 U2.3(IN+)
NetR19_2: R19.2 U2.4(IN-)

### Layout directives
net class BAT: BAT-, C1, C2, C4, VBAT

### Notes on the sheet
- 5S
- (near TP14) 4S
- C3
- I2C Address:
  0b0001000 (0x08)
- Adjustment to change from 4S to 5S configuration:
  - remove connection
  between C2 and C3 (red)
  - Change text "C3" to
  net label
  - Change BAT2 to
  BAT_LFP-26700-4.5AH
- (near R18) Remove R17 and C12
- (near U2) Replace U2 with INA181A1
  Connect pin 5 of INA181 to VREF/2
- Change R18 and R19 to 10Ω
- SMD thermistor for testing purposes only
- Remove R20 and C14
- Date:
- Size:
- A3
- Schema:
- Layout:
- (in symbol 10K/40MM/NTC/3380K) -ϑ
- (in symbol 10K/0603/NTC/3380K) -ϑ

### Library data of the parts
BAT1-BAT9 = BAT_LFP-26700-4.5AH: Battery LiFePO4 26700 4.5Ah; Manufacturer: Tenpower; Manufacturer Part Number 1: IFR26700-45HE; Part Number: BAT_LFP-26700-4.5AH; HelpURL: https://www.tenpowercell.com/wp-content/uploads/2023/08/TP-IFR26700-45HE-Product-Datasheet-v1.4.pdf; Manufacturer 1: Tenpower; Supplier 1: NKON; Supplier Part Number 1: 6097321571573
C1 C4 = 1U/0603/50V/X5R: CAP SM 0603 1.0uF 50V X5R; Manufacturer: GENERIC; Manufacturer 1: Samsung Electro-Mechanics; Manufacturer Part Number 1: CL10A105KB8NNNC; Absolute Value: 1E-6; Eurocircuits GPN: GPC0603105-X5R; Part Number: 1U/0603/50V/X5R; Package: 0603; Value: 1.0uF; HelpURL: https://mm.digikey.com/Volume0/opasdata/d220001/medias/docus/658/CL10A105KB8NNNC_Spec.pdf; Supplier 1: Digi-Key; Supplier Part Number 1: 1276-1860-1-ND; Manufacturer Part Number 3: CL10A105KB8NNNC; Supplier 3: LCSC; Supplier Part Number 3: C15849; JLC Type: Basic
C2 C3 C5-C10 C13 = 100N/0603/50V/X7R: as C97 on sheet Microcontroller; Part Number: 100N/0603/50V/X7R; Package: 0603; Value: 100nF; HelpURL: https://www.yageo.com/upload/media/product/app/datasheet/mlcc/upy-gphc_x7r_6_3v-to-250v.pdf; Supplier 1: Digi-Key; Supplier Part Number 1: 311-3567-1-ND; Supplier 3: LCSC; Supplier Part Number 3: C14663; Manufacturer 2: YAGEO; Manufacturer Part Number 2: CC0603MRX7R9BB104; Supplier 2: Digi-Key; Supplier Part Number 2: 311-4110-1-ND; JLC Type: Basic; Manufacturer Part Number 3: CC0603KRX7R9BB104
C11 = 1N/0603/50V/X7R: CAP SM 0603 1.0nF 50V X7R; Manufacturer: GENERIC; Manufacturer 1: YAGEO; Manufacturer Part Number 1: CC0603KPX7R9BB102; Absolute Value: 1E-9; Eurocircuits GPN: GPC0603102; Part Number: 1N/0603/50V/X7R; Package: 0603; Value: 1.0nF; HelpURL: https://www.yageo.com/upload/media/product/app/datasheet/mlcc/upy-gphc_x7r_6_3v-to-250v.pdf; Supplier 1: Digi-Key; Supplier Part Number 1: 13-CC0603KPX7R9BB102CT-ND; Manufacturer 2: YAGEO; Manufacturer Part Number 2: CC0603KRX7R9BB102; Supplier 2: Digi-Key; Supplier Part Number 2: 311-1080-1-ND; Manufacturer Part Number 3: CL10B102KB8NNNC; Supplier 3: LCSC; Supplier Part Number 3: C1588; JLC Type: Basic
D1-D3 = B5819W SL: 40V 600mV@1A 1A SOD-123 Schottky Barrier Diodes; Manufacturer: GENERIC; Manufacturer 1: SMC Diode Solutions; Part Number: B5819W SL; Package: SOD-123; Value: B5819W SL; Absolute Value: 40V; HelpURL: https://datasheet.lcsc.com/lcsc/2304140030_Jiangsu-Changjing-Electronics-Technology-Co---Ltd--B5819W-SL_C8598.pdf; Manufacturer 3: Jiangsu Changjing Electronics Technology Co., Ltd.; Manufacturer Part Number 3: B5819W SL; Supplier 3: LCSC; Supplier Part Number 3: C8598; JLC Type: Basic; Manufacturer Part Number 1: B5819WSL; Supplier 1: Digikey; Supplier Part Number 1: 1655-B5819WSLCT-ND
D4 = DDZ9678: Low current zener diode 1.8V 500mW SOD123; Manufacturer: Diodes Incorporated; Manufacturer Part Number 1: DDZ9678-7; Part Number: DDZ9678; Package: SOD-123; Value: 1.8V; Absolute Value: 1.8V; HelpURL: https://www.diodes.com/datasheet/download/DDZ96xx-DDZ97xx.pdf; Manufacturer 1: Diodes Incorporated; Supplier 1: Digikey; Supplier Part Number 1: DDZ9678DICT-ND; Manufacturer 3: DIODES; Manufacturer Part Number 3: DDZ9678-7; Supplier 3: LCSC; Supplier Part Number 3: C150464; JLC Type: Extended
J1 = Solder_Jumper_2pin_0.3mm: Solder jumper with two pins with a spacing of 0.3mm; Manufacturer: NONE; Part Number: Solder_Jumper_2pin_0.3mm
NT1 = NET-TIE_1000X100-I4: Net-Tie 10.00mmx1.00mm Inner Layer 4; Manufacturer: NONE; Part Number: NET-TIE_1000X100-I4; Width: 10.00m; Length: 1.00mm; Layer: Inner Layer 4
Q1 = BSS84: 50V P-Channel MOSFET; Manufacturer: GENERIC; Manufacturer 1: Good-Ark Semiconductor; Part Number: BSS84; Package: SOT23; HelpURL: https://goodarksemi.com/docs/datasheets/mosfets/BSS84.pdf; Manufacturer 3: Jiangsu Changjing Electronics Technology Co., Ltd.; Manufacturer Part Number 3: BSS84; Supplier 3: LCSC; Supplier Part Number 3: C114481; Manufacturer Part Number 1: BSS84; Supplier 1: Digi-Key; Supplier Part Number 1: 4786-BSS84CT-ND; Manufacturer 2: LRC; Manufacturer Part Number 2: LBSS84LT1G; Supplier 2: LCSC; Supplier Part Number 2: C8492; JLC Type: Extended
Q2 = BSS138: N-Kanal 50 V 220mA (Ta) 350mW (Ta) Oberflächenmontage SOT-23; Manufacturer: GENERIC; Manufacturer 1: ANBON SEMICONDUCTOR (INT'L) LIMITED; Part Number: BSS138; Package: SOT23; HelpURL: https://mm.digikey.com/Volume0/opasdata/d220001/medias/docus/3037/BSS138.pdf; Manufacturer Part Number 1: BSS138; Supplier 1: Digi-Key; Supplier Part Number 1: 4530-BSS138CT-ND; Manufacturer 3: FOSAN; Manufacturer Part Number 3: BSS138; Supplier 3: LCSC; Supplier Part Number 3: C2926186; JLC Type: Extended; Manufacturer 2: FOSAN; Manufacturer Part Number 2: BSS138; Supplier 2: LCSC; Supplier Part Number 2: C2926186
R1 R2 R18 R19 = 10R/0603: RES SM 0603 10R; Manufacturer: GENERIC; Manufacturer 1: YAGEO; Manufacturer Part Number 1: RC0603FR-1310RL; Absolute Value: 10; Eurocircuits GPN: GPR060310R; Part Number: 10R/0603; Package: 0603; Value: 10R; HelpURL: https://www.yageogroup.com/content/datasheet/asset/file/PYU-RC_GROUP_51_ROHS_L; Supplier 1: Digi-Key; Supplier Part Number 1: 13-RC0603FR-1310RLCT-ND; Manufacturer 2: YAGEO; Manufacturer Part Number 2: RC0603FR-1010RL; Supplier 2: Digi-Key; Supplier Part Number 2: 13-RC0603FR-1010RLCT-ND; JLC Type: Basic; Manufacturer 3: UNI-ROYAL; Manufacturer Part Number 3: 0603WAF100JT5E; Supplier 3: LCSC; Supplier Part Number 3: C22859
R3 R5 R7-R11 R13 = 100R/0603: RES SM 0603 100R; Manufacturer: GENERIC; Manufacturer 1: YAGEO; Manufacturer Part Number 1: RC0603FR-13100RL; Absolute Value: 100; Eurocircuits GPN: GPR0603100R; Part Number: 100R/0603; Package: 0603; Value: 100R; HelpURL: https://www.yageogroup.com/content/datasheet/asset/file/PYU-RC_GROUP_51_ROHS_L; Supplier 1: Digi-Key; Supplier Part Number 1: 13-RC0603FR-13100RLCT-ND; Manufacturer 2: YAGEO; Manufacturer Part Number 2: RC0603FR-10100RL; Supplier 2: Digi-Key; Supplier Part Number 2: 13-RC0603FR-10100RLCT-ND; Manufacturer 3: UNI-ROYAL(Uniroyal Elec); Manufacturer Part Number 3: 0603WAF1000T5E; Supplier 3: LCSC; Supplier Part Number 3: C22775
R4 R12 = 10M/0603: RES SM 0603 10M; Manufacturer: GENERIC; Manufacturer 1: YAGEO; Manufacturer Part Number 1: RC0603FR-1310ML; Absolute Value: 10000000; Eurocircuits GPN: GPR060310M; Part Number: 10M/0603; Package: 0603; Value: 10M; HelpURL: https://www.yageogroup.com/content/datasheet/asset/file/PYU-RC_GROUP_51_ROHS_L; Supplier 1: Digi-Key; Supplier Part Number 1: 13-RC0603FR-1310MLCT-ND; Manufacturer 2: YAGEO; Manufacturer Part Number 2: RC0603FR-1010ML; Supplier 2: Digi-Key; Supplier Part Number 2: 13-RC0603FR-1010MLCT-ND; Manufacturer 3: UNI-ROYAL(Uniroyal Elec); Manufacturer Part Number 3: 0603WAF1005T5E; Supplier 3: LCSC; Supplier Part Number 3: C7250; JLC Type: Basic
R6 = 1M/0603: RES SM 0603 1M; Manufacturer: GENERIC; Manufacturer 1: YAGEO; Manufacturer Part Number 1: RC0603FR-131ML; Absolute Value: 1000000; Eurocircuits GPN: GPR06031M; Part Number: 1M/0603; Package: 0603; Value: 1M; HelpURL: https://www.yageogroup.com/content/datasheet/asset/file/PYU-RC_GROUP_51_ROHS_L; Supplier 1: Digi-Key; Supplier Part Number 1: 13-RC0603FR-131MLCT-ND; JLC Type: Basic; Manufacturer 3: UNI-ROYAL(Uniroyal Elec); Manufacturer Part Number 3: 0603WAF1004T5E; Supplier 3: LCSC; Supplier Part Number 3: C22935; Manufacturer 2: YAGEO; Manufacturer Part Number 2: RC0603FR-101ML; Supplier 2: Digi-Key; Supplier Part Number 2: 13-RC0603FR-101MLCT-ND
R14 = 0R005/2512: RES SM 2512 0R005; Manufacturer: GENERIC; Manufacturer 1: Ohmite; Manufacturer Part Number 1: MCS3264R005FER; Absolute Value: 0.005; Part Number: 0R005/2512; Package: 2512; Value: 0R005; HelpURL: https://www.ohmite.com/assets/docs/res_mcs.pdf?r=false; Supplier 1: Digi-Key; Supplier Part Number 1: MCS3264R005FERCT-ND; Manufacturer 3: prosemi; Manufacturer Part Number 3: LMP25MF2P0R005; Supplier 3: LCSC; Supplier Part Number 3: C2937402
R15 = 10K/40MM/NTC/3380K: RES NTC THT 40mm 10K 3380K; Manufacturer: GENERIC; Manufacturer 1: Eaton - Electronics Division; Manufacturer Part Number 1: NRSE104F3380B1F; Absolute Value: 10000; Part Number: 10K/40MM/NTC/3380K; Value: 10K; HelpURL: https://eaton.com/content/dam/eaton/products/electronic-components/resources/data-sheet/eaton-nrse-epoxy-sealed-radial-lead-ntc-thermistor-data-sheet-elx1227.pdf; Supplier 1: Digi-Key; Supplier Part Number 1: 283-NRSE104F3380B1F-ND
R16 = 10K/0603/NTC/3380K: RES NTC SM 0603 10K; Manufacturer: GENERIC; Manufacturer 1: Murata; Manufacturer Part Number 1: NCU18XH103E60RB; Absolute Value: 10000; Eurocircuits GPN: GPR060310K; Part Number: 10K/0603/NTC/3380K; Package: 0603; Value: 10K; HelpURL: https://www.murata.com/en-us/api/pdfdownloadapi?cate=luNTCforTempeSenso&partno=NCU18XH103E60RB; Supplier 1: Digi-Key; Supplier Part Number 1: 490-18164-1-ND; Manufacturer 3: Sunlord; Manufacturer Part Number 3: SDNT1608X103F3380FTF; Supplier 3: LCSC; Supplier Part Number 3: C316397; JLC Type: Extended
R21 = 1K/0603: as R235 on sheet Microcontroller; Part Number: 1K/0603; Package: 0603; Value: 1K; HelpURL: https://www.yageogroup.com/content/datasheet/asset/file/PYU-RC_GROUP_51_ROHS_L; Supplier 1: Digi-Key; Supplier Part Number 1: 13-RC0603FR-131KLCT-ND; Manufacturer 2: YAGEO; Manufacturer Part Number 2: RC0603FR-101KL; Supplier 2: Digi-Key; Supplier Part Number 2: 13-RC0603FR-101KLCT-ND; Manufacturer 3: UNI-ROYAL(Uniroyal Elec); Manufacturer Part Number 3: 0603WAF1001T5E; Supplier 3: LCSC; Supplier Part Number 3: C21190; JLC Type: Basic
TP14-TP18 = TP_THD_1.5/0.8: as TP1 on sheet ST1-1-Top; Part Number: TP_THD_1.5/0.8
U1 = BQ76905: BQ76905 2-Series to 5-Series High Accuracy Battery Monitor and Protector for Li-Ion, Li-Polymer, LiFePO4 (LFP), and LTO Battery Packs; Manufacturer: Texas Instruments; Manufacturer Part Number 1: BQ76905RGRR; Part Number: BQ76905; HelpURL: https://www.ti.com/lit/ds/symlink/bq76905.pdf; Manufacturer 1: Texas Instruments; Supplier 1: Digi-Key; Supplier Part Number 1: 296-BQ76905RGRRCT-ND; Manufacturer 3: Texas Instruments; Manufacturer Part Number 3: BQ76905RGRR; Supplier 3: LCSC; Supplier Part Number 3: C22394458
U2 = INA181A1 SOT23: INA181A1, Bidirectional, Low- and High-Side Voltage Output, Current-Sense Amplifier, 20 V/V, SOT23; Manufacturer: Texas Instruments; Manufacturer Part Number 1: INA181A1IDBVR; Part Number: INA181A1 SOT23; Package: SOT23-6; HelpURL: https://www.ti.com/lit/ds/symlink/ina181.pdf; Manufacturer 1: Texas Instruments; Supplier 1: Digi-Key; Supplier Part Number 1: 296-47656-1-ND; Manufacturer 3: Texas Instruments; Manufacturer Part Number 3: INA181A1IDBVR; Supplier 3: LCSC; Supplier Part Number 3: C2058943; Manufacturer 2: Texas Instruments; Manufacturer Part Number 2: INA181A1IDBVT; Supplier 2: Digi-Key; Supplier Part Number 2: 296-46634-1-ND; Manufacturer 4: Texas Instruments; Manufacturer Part Number 4: INA181A1IDBVT; Supplier 4: LCSC; Supplier Part Number 4: C2861997; JLC Type: Extended